# EAGLE schematic sound_detector (EAGLE 9.2.2)
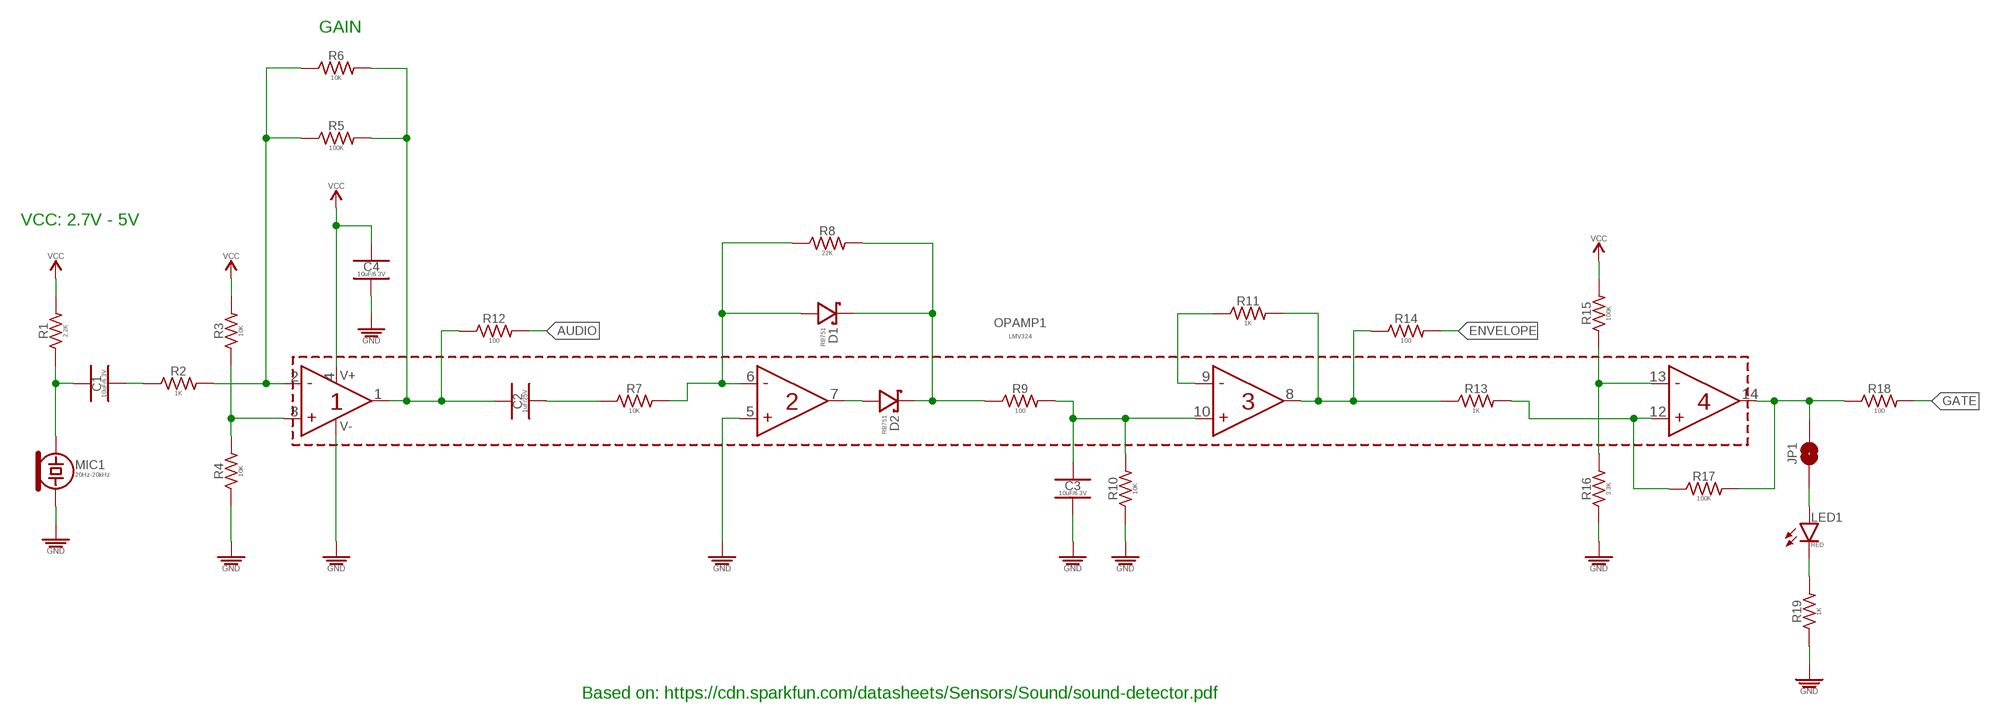
[diagram p0: schematic, sheet 1]

## Parts
C1  10uF/6.3V  10UF_CER_SMD-0402_6.3V-20%  [CAPC1005X55_SMD-0402]
C2  1uF/25V  1UF_CER_SMD-0402_25V-10%  [CAPC1005X55_SMD-0402]
C3  10uF/6.3V  10UF_CER_SMD-0402_6.3V-20%  [CAPC1005X55_SMD-0402]
C4  10uF/6.3V  10UF_CER_SMD-0402_6.3V-20%  [CAPC1005X55_SMD-0402]
D1  RB751  SCHOTTKY_RB751_SCHOTTKY_30MA_40V_0.37VF_SOD-523  [SODFL1608X70]
D2  RB751  SCHOTTKY_RB751_SCHOTTKY_30MA_40V_0.37VF_SOD-523  [SODFL1608X70]
JP1  JUMPER_SMD_2-PAD_NO_SILK  [SMT-JUMPER_2_NO_SILK]
LED1  RED  LED_SMD-0402_DISCRETE_RED  [LEDC1005X40_LED-0402]
MIC1  20Hz-20kHz  MICROPHONECMA-4544PF_20HZ-20KHZ_2.2KOHM  [MICROPHONE_D9.7]
OPAMP1  LMV324  [SOIC127P600X175-14]
R1  2.2K  2.2KΩ_SMD-0402_1/16W-5%  [RESC1005X35_SMD-0402]
R2  1K  1KΩ_SMD-0402_1/16W-5%  [RESC1005X35_SMD-0402]
R3  10K  10KΩ_SMD-0402_1/16W-5%  [RESC1005X35_SMD-0402]
R4  10K  10KΩ_SMD-0402_1/16W-5%  [RESC1005X35_SMD-0402]
R5  100K  100K_SMD-0402_1/16W_5%  [RESC1005X35_SMD-0402]
R6  10K  10KΩ_SMD-0402_1/16W-5%  [RESC1005X35_SMD-0402]
R7  10K  10KΩ_SMD-0402_1/16W-5%  [RESC1005X35_SMD-0402]
R8  22K  22KΩ_SMD-0402_1/16W-5%  [RESC1005X35_SMD-0402]
R9  100  100Ω_SMD-0402_1/16W-5%  [RESC1005X35_SMD-0402]
R10  10K  10KΩ_SMD-0402_1/16W-5%  [RESC1005X35_SMD-0402]
R11  1K  1KΩ_SMD-0402_1/16W-5%  [RESC1005X35_SMD-0402]
R12  100  100Ω_SMD-0402_1/16W-5%  [RESC1005X35_SMD-0402]
R13  1K  1KΩ_SMD-0402_1/16W-5%  [RESC1005X35_SMD-0402]
R14  100  100Ω_SMD-0402_1/16W-5%  [RESC1005X35_SMD-0402]
R15  100K  100K_SMD-0402_1/16W_5%  [RESC1005X35_SMD-0402]
R16  3.3K  3.3KΩ_SMD-0402_1/16W-1%  [RESC1005X35_SMD-0402]
R17  100K  100K_SMD-0402_1/16W_5%  [RESC1005X35_SMD-0402]
R18  100  100Ω_SMD-0402_1/16W-5%  [RESC1005X35_SMD-0402]
R19  1K  1KΩ_SMD-0402_1/16W-5%  [RESC1005X35_SMD-0402]

## Nets
AMP_ENVELOPE: OPAMP1.8(OUT-3) R11.2 R13.1 R14.1
AUDIO: R12.2
ENVELOPE: R14.2
GATE: R18.2
GND: C3.2 C4.2 MIC1.2 OPAMP1.5(IN-2+) OPAMP1.11(V-) R4.1 R10.1 R16.1 R19.1
N$1: C1.2 R2.1
N$2: OPAMP1.2(IN-1-) R2.2 R5.1 R6.1
N$3: OPAMP1.3(IN-1+) R3.1 R4.2
N$4: C1.1 MIC1.1 R1.1
N$5: C2.1 OPAMP1.1(OUT-1) R5.2 R6.2 R12.1
N$6: C2.2 R7.1
N$7: D1.K OPAMP1.6(IN-2-) R7.2 R8.1
N$8: D1.A D2.A R8.2 R9.1
N$9: D2.K OPAMP1.7(OUT-2)
N$10: OPAMP1.9(IN-3-) R11.1
N$11: C3.1 OPAMP1.10(IN-3+) R9.2 R10.2
N$12: OPAMP1.12(IN-4+) R13.2 R17.1
N$13: OPAMP1.13(IN-4-) R15.1 R16.2
N$14: JP1.2 OPAMP1.14(OUT-4) R17.2 R18.1
N$15: JP1.1 LED1.A
N$16: LED1.K R19.2
VCC: C4.1 OPAMP1.4(V+) R1.2 R3.2 R15.2

## Notes on the sheet
- GAIN
- VCC: 2.7V - 5V
- Based on: https://cdn.sparkfun.com/datasheets/Sensors/Sound/sound-detector.pdf

## Library data of the parts
C1 C3 C4 = PiB_capacitors:10UF; DATASHEET: https://www.murata.com/~/media/webrenewal/support/library/catalog/products/capacitor/mlcc/c02e.ashx; DIST: Digikey; DISTLINK: https://www.digikey.com/products/en?keywords=490-13233-1-ND; DISTPN: 490-13233-1-ND; MFR: Murata Electronics North America; MPN: GRM155C80J106ME11D
C2 = PiB_capacitors:1UF; DATASHEET: https://product.tdk.com/info/en/catalog/datasheets/mlcc_commercial_lowprofile_en.pdf; DIST: Digikey; DISTLINK: https://www.digikey.com/products/en?keywords=445-13185-1-ND; DISTPN: 445-13185-1-ND; MFR: TDK Corporation; MPN: CGB2A1X5R1E105K033BC
D1 D2 = PiB_discrete_semiconductors:SCHOTTKY; DATASHEET: https://www.onsemi.com/pub/Collateral/RB751S40T1-D.PDF; DIST: Digikey; DISTLINK: https://www.digikey.com/products/en?keywords=RB751S40T5GOSCT-ND; DISTPN: RB751S40T5GOSCT-ND; MFR: ON Semiconductor; MPN: RB751S40T5G
JP1 = PiB_connectors:JUMPER_SMD_2-PAD_NO: Normally open jumper
LED1 = PiB_leds:LED; DATASHEET: https://www.bivar.com/portals/0/products/SM0402RC.pdf; DIST: Digikey; DISTLINK: https://www.digikey.com/products/en?keywords=492-2208-1-ND; DISTPN: 492-2208-1-ND; MFR: Bivar Inc.; MPN: SM0402RC
MIC1 = PiB_sound:MICROPHONE; DATASHEET: https://www.cui.com/product/resource/cma-4544pf-w.pdf; DIST: Digikey; DISTLINK: https://www.digikey.com/products/en?keywords=102-1721-ND; DISTPN: 102-1721-ND; MFR: CUI Inc.; MPN: CMA-4544PF-W
OPAMP1 = PiB_op_amps:LMV324; DATASHEET: http://www.ti.com/lit/ds/symlink/lmv324.pdf; DIST: Digikey; DISTLINK: https://www.digikey.com/products/en?keywords=296-9569-1-ND; DISTPN: 296-9569-1-ND; MFR: Texas Instruments; MPN: LMV324IDR
R1 = PiB_resistors:2.2KΩ; DATASHEET: http://www.yageo.com/documents/recent/PYu-RC_Group_51_RoHS_L_9.pdf; DIST: Digikey; DISTLINK: https://www.digikey.com/products/en?keywords=311-2.2KJRCT-ND; DISTPN: 311-2.2KJRCT-ND; MFR: Yageo; MPN: RC0402JR-072K2L
R2 R11 R13 R19 = PiB_resistors:1KΩ; DATASHEET: http://www.yageo.com/NewPortal/yageodocoutput?fileName=/pdf/R-Chip/PYu-AC_51_RoHS_L_6.pdf; DIST: Digikey; DISTLINK: https://www.digikey.com/products/en?keywords=YAG3525CT-ND; DISTPN: YAG3525CT-ND; MFR: Yageo; MPN: AC0402JR-071KL
R3 R4 R6 R7 R10 = PiB_resistors:10KΩ; DATASHEET: http://www.yageo.com/NewPortal/yageodocoutput?fileName=/pdf/R-Chip/PYu-RC_51_RoHS_P_0.pdf; DIST: Digikey; DISTLINK: https://www.digikey.com/products/en?keywords=YAG1281CT-ND; DISTPN: YAG1281CT-ND; MFR: Yageo; MPN: RC0402JR-0710KP
R5 R15 R17 = PiB_resistors:100K; DATASHEET: http://www.yageo.com/documents/recent/PYu-RC_Group_51_RoHS_L_9.pdf; DIST: Digikey; DISTLINK: https://www.digikey.com/products/en?keywords=311-100KJRCT-ND; DISTPN: 311-100KJRCT-ND; MFR: Yageo; MPN: RC0402JR-07100KL
R8 = PiB_resistors:22KΩ; DATASHEET: http://www.yageo.com/documents/recent/PYu-RC_Group_51_RoHS_L_9.pdf; DIST: Digikey; DISTLINK: https://www.digikey.com/products/en?keywords=311-3.30KLRCT-ND; DISTPN: 311-22KJRCT-ND; MFR: Yageo; MPN: RC0402JR-0722KL
R9 R12 R14 R18 = PiB_resistors:100Ω; DATASHEET: http://www.yageo.com/NewPortal/yageodocoutput?fileName=/pdf/R-Chip/PYu-AC_51_RoHS_L_6.pdf; DIST: Digikey; DISTLINK: https://www.digikey.com/products/en?keywords=YAG3516CT-ND; DISTPN: YAG3516CT-ND; MFR: Yageo; MPN: AC0402JR-07100RL
R16 = PiB_resistors:3.3KΩ; DATASHEET: http://www.yageo.com/documents/recent/PYu-RC_Group_51_RoHS_L_9.pdf; DIST: Digikey; DISTLINK: https://www.digikey.com/products/en?keywords=311-3.30KLRCT-ND; DISTPN: 311-3.30KLRCT-ND; MFR: Yageo; MPN: RC0402FR-073K3L